# EAGLE design Triple (EAGLE 7.1.0)
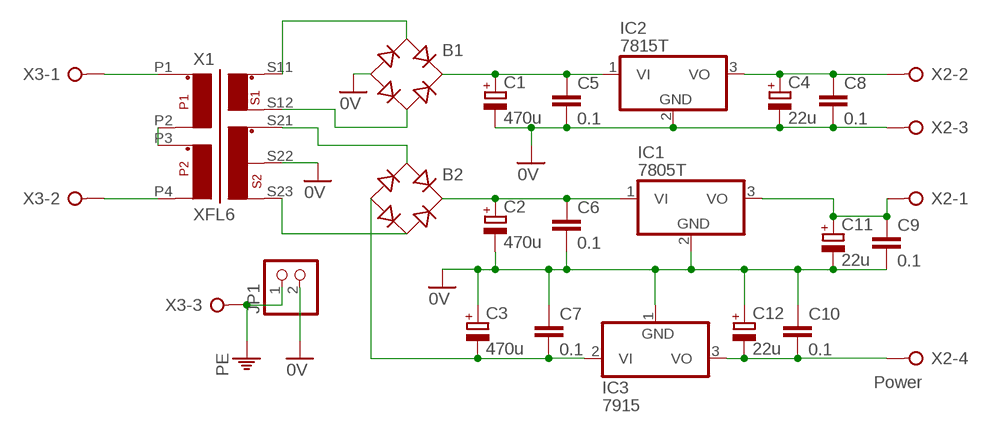
[diagram p0: schematic, sheet 1]

## Parts
B1  RB1A  [RB1A]
B2  RB1A  [RB1A]
C1  470u  CPOL-EUE5-10.5  [E5-10,5]
C2  470u  CPOL-EUE5-10.5  [E5-10,5]
C3  470u  CPOL-EUE5-10.5  [E5-10,5]
C4  22u  CPOL-EUE5-10.5  [E5-10,5]
C5  0.1  C-EU050-025X075  [C050-025X075]
C6  0.1  C-EU050-025X075  [C050-025X075]
C7  0.1  C-EU050-025X075  [C050-025X075]
C8  0.1  C-EU050-025X075  [C050-025X075]
C9  0.1  C-EU050-025X075  [C050-025X075]
C10  0.1  C-EU050-025X075  [C050-025X075]
C11  22u  CPOL-EUE5-10.5  [E5-10,5]
C12  22u  CPOL-EUE5-10.5  [E5-10,5]
IC1  7805T  [TO220H]
IC2  7815T  [TO220H]
IC3  7915  7915T  [TO220H]
JP1  PINHD-1X2  [1X02]
X1  XFL6  [FL6]
X2  Power  W237-04P  [W237-4P]
X3  W237-03P  [W237-133]

## Nets
0V: B1.- C1.- C2.- C3.+ C4.- C5.2 C6.2 C7.1 C8.2 C9.2 C10.1 C11.- C12.+ IC1.2(GND) IC2.2(GND) IC3.1(GND) JP1.2 X1.S22 X2.3
+5V: C4.+ C8.1 IC2.3(VO) X2.2
+15V: C9.1 C11.+ IC1.3(VO) X2.1
-15V: C10.2 C12.- IC3.3(VO) X2.4
N$1: X1.P2 X1.P3
N$2: X1.P1 X3.1
N$3: X1.P4 X3.2
N$4: B1.AC1 X1.S11
N$5: B1.AC2 X1.S12
N$6: B2.AC1 X1.S21
N$7: B2.AC2 X1.S23
N$12: B1.+ C1.+ C5.1 IC2.1(VI)
PE: JP1.1 X3.3
VCC: B2.+ C2.+ C6.1 IC1.1(VI)
VDD: B2.- C3.- C7.2 IC3.2(VI)

## Library data of the parts
B1 B2 = rectifier:RB1A: RECTIFIER 1 A
C1-C4 C11 C12 = rcl:CPOL-EU: POLARIZED CAPACITOR, European symbol
C5-C10 = rcl:C-EU: CAPACITOR, European symbol
IC1 IC2 = linear:78*: Positive VOLTAGE REGULATOR Source: http://cache.national.com/ds/LM/LM78L05.pdf http://www.fairchildsemi.com/ds/LM/LM7805.pdf
IC3 = linear:79*: Negative VOLTAGE REGULATOR
JP1 = pinhead:PINHD-1X2: PIN HEADER
X1 = custom_parts:XFL6: Block FL6 6W transmormer, triple output
X2 = con-wago-508:W237-04P: WAGO SREW CLAMP; OC_FARNELL: unknown; OC_NEWARK: unknown
X3 = con-wago-508:W237-03P: WAGO SREW CLAMP; OC_FARNELL: unknown; OC_NEWARK: unknown

## Board
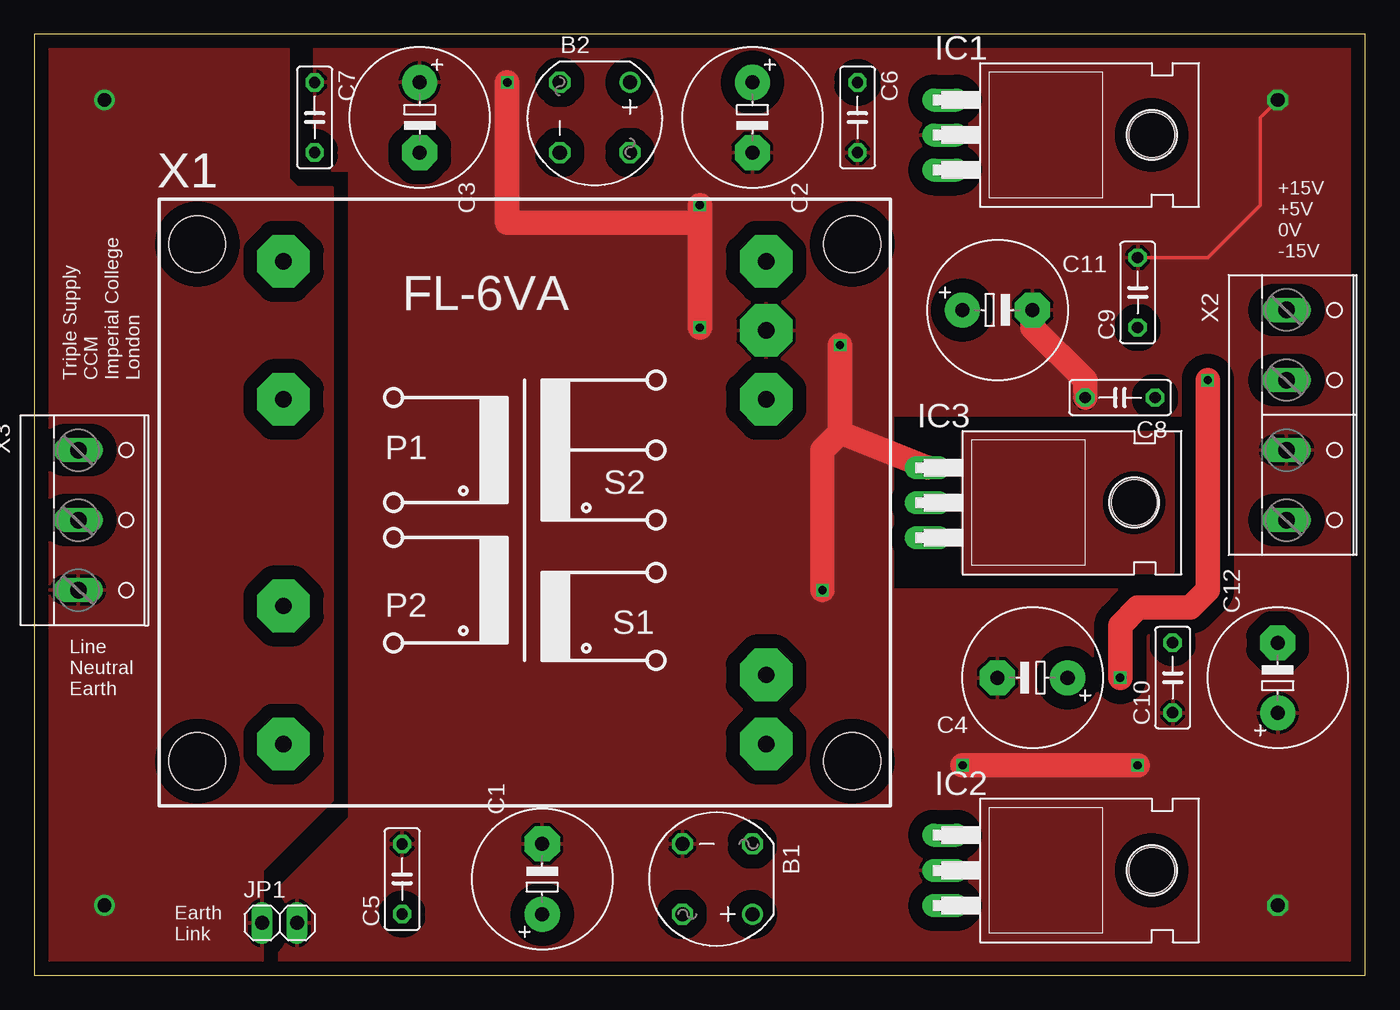
[diagram p1: board, top side]
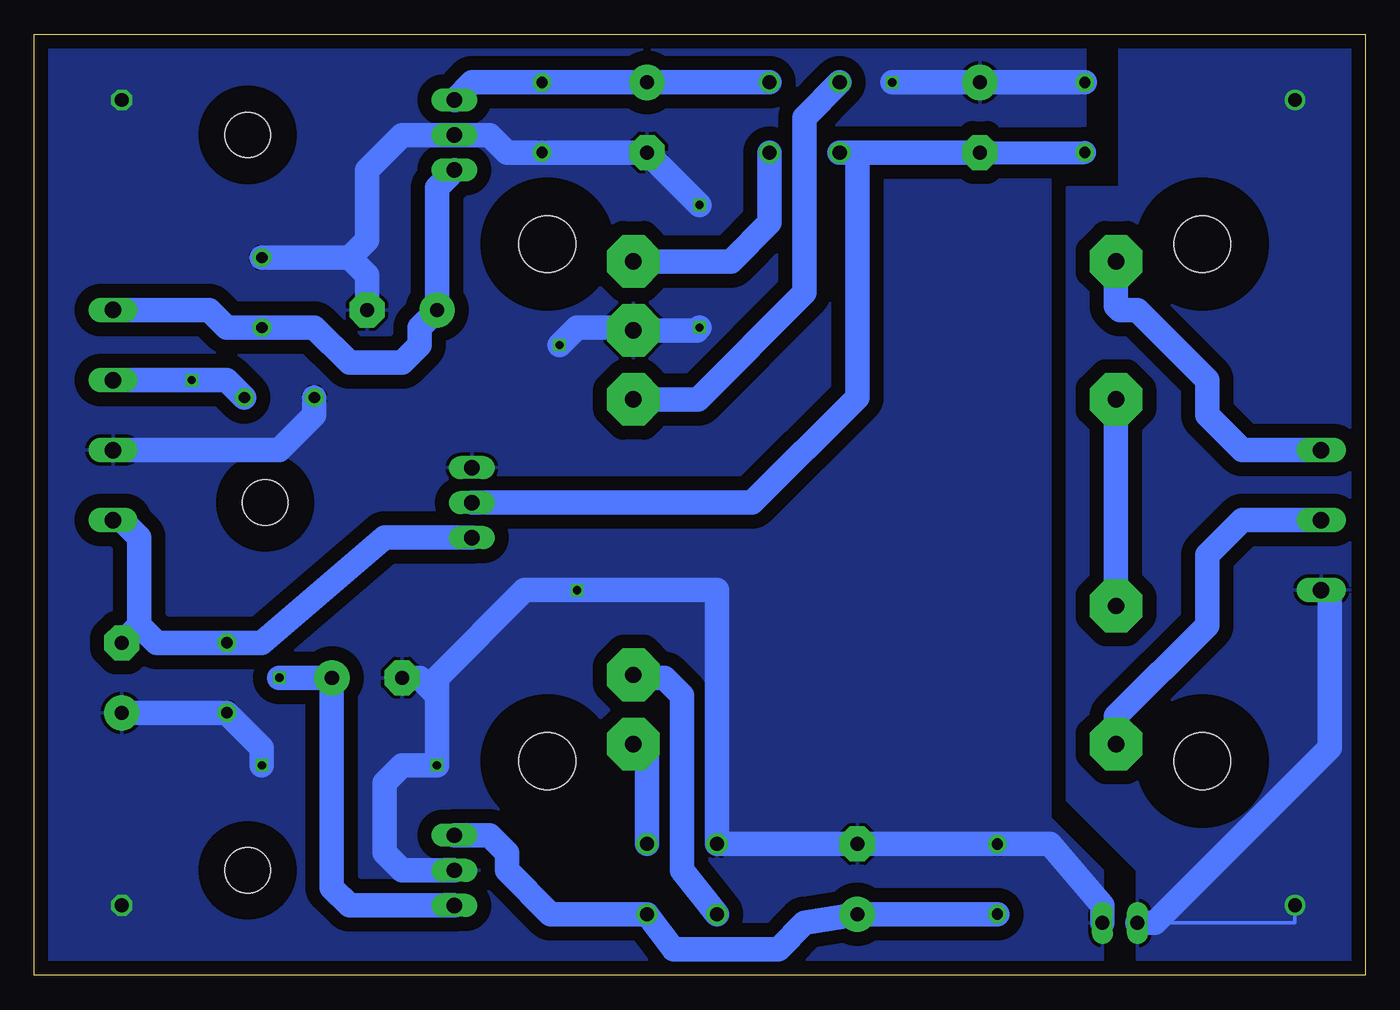
[diagram p2: board, bottom side, seen from below]

Size 96.5 x 68.25 mm. Coordinates in mm from the lower left corner, seen from the top.
Outline: 0,0 96.5,0 96.5,68.25 0,68.25 0,0
Copper layers (1*16): Top 0.035mm / dielectric 1.5mm / Bottom 0.035mm
Design rules "dirt_cheap_dirty_boards.v1": minimum track width 5mil, minimum drill 12mil, track to track 5mil, track to pad 5mil, pad to pad 5mil, via to via 5mil, smd to smd 0mil, copper to edge 10mil, drill to drill 10mil, minimum pad ring 10mil, minimum via ring 6mil, stop-mask expansion 2mil, vias tented up to drill 25mil, thermal gap 10mil

### Footprints (pad centres in the part's own frame; a part is rotated, then mirrored left to right if it is on the bottom)
RB1A = drill 1.016: + -2.54,2.54 | drill 1.016 octagon: - 2.54,-2.54; AC1 2.54,2.54; AC2 -2.54,-2.54
E5-10,5 = drill 1.016 pad 2.54: + -2.54,0 | drill 1.016 pad 2.54 octagon: - 2.54,0
C050-025X075 = drill 0.813 octagon: 1 -2.54,0; 2 2.54,0
TO220H = drill 1.118 long: 1 -2.54,-10.16; 2 0,-10.16; 3 2.54,-10.16 | hole 3.302: 0,4.826
1X02 = drill 1.016 long: 1 -1.27,0; 2 1.27,0
FL6 = drill 1.194 pad 3.81 octagon: P1 -17.501,17.501; P2 -17.501,7.493; P3 -17.501,-7.493; P4 -17.501,-17.501; S11 17.501,-12.497; S12 17.501,-17.501; S21 17.501,17.501; S22 17.501,12.497; S23 17.501,7.493 | hole 4.115: 23.749,18.745; 23.749,-18.745; -23.749,-18.745; -23.749,18.745
W237-4P = drill 1.194 long: 1 -7.62,-0.635; 2 -2.54,-0.635; 3 2.54,-0.635; 4 7.62,-0.635
W237-133 = drill 1.194 long: 1 -5.08,-0.635; 2 0,-0.635; 3 5.08,-0.635

### Placement (x,y rotation side)
B1  49.53,6.99 180 top
B2  40.64,62.23 270 top
C1  36.83,6.99 90 top
C2  52.07,62.23 270 top
C3  27.94,62.23 270 top
C4  72.39,21.59 180 top
C5  26.67,6.99 90 top
C6  59.69,62.23 270 top
C7  20.32,62.23 270 top
C8  78.74,41.91 180 top
C9  80.01,49.53 90 top
C10  82.55,21.59 90 top
C11  69.85,48.26 0 top
C12  90.17,21.59 90 top
IC1  76.2,60.96 270 top
IC2  76.2,7.62 270 top
IC3  74.93,34.29 270 top
JP1  17.78,3.81 0 top
X1  35.56,34.29 0 top
X2  91.44,40.64 270 top
X3  3.81,33.02 270 top

### Tracks (layer width: path | path; a pad name or v marks a point on that pad's centre or on a via)
0V  (via drill 0.6, 1)
  Top 0.254: C9.2 85.09,52.07 88.9,55.88 88.9,62.23 v90.17,63.5
  Top 1.778: v48.26,46.99 48.26,54.61 | 48.26,54.61 v48.26,55.88 | v34.29,64.77 34.29,54.61 48.26,54.61 | v80.01,15.24 v67.31,15.24 | v57.15,27.94 57.15,38.1 58.42,39.37 | 58.42,39.37 v58.42,45.72 | C8.2 76.2,43.18 72.39,46.99 C11.- | IC3.1 58.42,39.37
  Bottom 1.778: C7.1 C3.+ v34.29,64.77 | JP1.2 19.05,5.08 22.86,9.53 C5.2 C1.- B1.- 46.99,27.94 v57.15,27.94 60.96,27.94 67.31,21.59 67.31,20.32 | v48.26,46.99 48.46,46.79 X1.S22 53.26,46.99 57.15,46.99 v58.42,45.72 | v48.26,55.88 C2.- C6.2 62.23,59.69 63.5,60.96 IC1.2 69.85,60.96 72.39,58.42 72.39,53.34 73.66,52.07 | 67.31,20.32 v67.31,15.24 69.85,15.24 71.12,13.97 71.12,8.89 69.85,7.62 IC2.2 | 67.31,20.32 68.58,21.59 C4.- | C9.2 73.66,52.07 | 73.66,52.07 72.39,50.8 C11.- | X2.3 78.74,38.1 76.2,40.64 C8.2 | v80.01,15.24 80.01,16.51 C10.1 C12.+
  other vias: 90.17,5.08
  pour Bottom (isolate 1.016): 19.05,0 19.05,7.62 22.86,11.43 22.86,59.69 20.32,59.69 20.32,67.94 96.52,67.94 96.52,0
  pour Top (isolate 1.016): 17.78,0 17.78,6.35 22.86,11.43 22.86,58.42 21.59,58.42 20.32,59.69 20.32,67.94 62.23,67.94 62.23,0
  pour Top (isolate 1.016): 62.23,40.64 62.23,67.94 96.52,67.94 96.52,27.94 85.09,27.94 85.09,40.64
  pour Top (isolate 1.016): 62.23,27.94 96.52,27.94 96.52,0 62.23,0
+5V  (via drill 0.6)
  Top 1.778: v78.74,21.59 78.74,25.4 80.01,26.67 83.82,26.67 85.09,27.94 v85.09,43.18
  Bottom 1.778: X2.2 v85.09,43.18 82.55,43.18 C8.1 | v78.74,21.59 C4.+ 74.93,6.35 73.66,5.08 IC2.3
+15V
  Bottom 1.778: X2.1 83.82,48.26 82.55,46.99 C9.1 76.2,46.99 73.66,44.45 69.85,44.45 68.58,45.72 68.58,46.99 C11.+ 67.31,57.15 IC1.3
-15V
  Bottom 1.778: X2.4 90.17,33.02 88.9,31.75 88.9,25.4 | 88.9,25.4 C12.- | 88.9,25.4 87.63,24.13 C10.2 80.01,24.13 71.12,31.75 IC3.3
N$1
  Bottom 1.778: X1.P2 18.06,26.95 17.78,26.67 17.93,26.67 X1.P3
N$2
  Bottom 1.778: X1.P1 18.06,48.54 17.78,48.26 16.51,48.26 11.43,43.18 11.43,40.64 8.89,38.1 X3.1
N$3
  Bottom 1.778: X1.P4 18.06,18.77 11.43,25.4 11.43,30.48 8.89,33.02 X3.2
N$4
  Bottom 1.778: B1.AC1 49.53,7.62 49.53,20.32 50.8,21.59 52.86,21.59 X1.S11
N$5
  Bottom 1.778: B1.AC2 52.07,15.8 X1.S12
N$6
  Bottom 1.778: X1.S21 46,51.79 43.18,54.61 B2.AC1
N$7
  Bottom 1.778: X1.S23 48.39,41.78 40.64,49.53 40.64,62.23 B2.AC2
N$8
  pour Top (isolate 0.61): 67.31,39.37 82.55,39.37 82.55,29.21 67.31,29.21
N$12
  Bottom 1.778: C5.1 C1.+ 40.64,3.81 42.54,1.91 50.16,1.91 B1.+ 59.05,4.45 62.23,7.62 62.23,8.89 63.5,10.16 IC2.1
PE  (via drill 1)
  Bottom 0.254: 15.24,3.81 5.08,3.81 v5.08,5.08
  Bottom 1.778: JP1.1 15.24,3.81 2.54,16.51 2.54,27.94 X3.3
  other vias: 5.08,63.5
  pour Bottom (isolate 1.016): 0,0 0,67.94 17.78,67.94 17.78,57.15 21.59,57.15 21.59,12.7 16.51,7.62 16.51,0
  pour Top (isolate 1.016): 0,0 0,67.94 18.41,67.94 18.41,57.78 19.05,57.15 21.59,57.15 21.59,12.7 16.51,7.62 16.51,0
VCC
  Bottom 1.778: B2.+ C2.+ C6.1 64.77,64.77 IC1.1
VDD
  Bottom 1.676: C3.- C7.2
  Bottom 1.778: B2.- 36.83,59.69 | 36.83,59.69 C3.- | 36.83,59.69 36.83,41.91 44.45,34.29 IC3.2

### Text on the board
tNames: +15V / +5V / 0V / -15V | Triple Supply / CCM / Imperial College / London | Line / Neutral / Earth | Earth / Link